# Altium schematic sheet Sheet2.SchDoc
size 209 x 297 mm; SheetNumber: 1; SheetTotal: 1
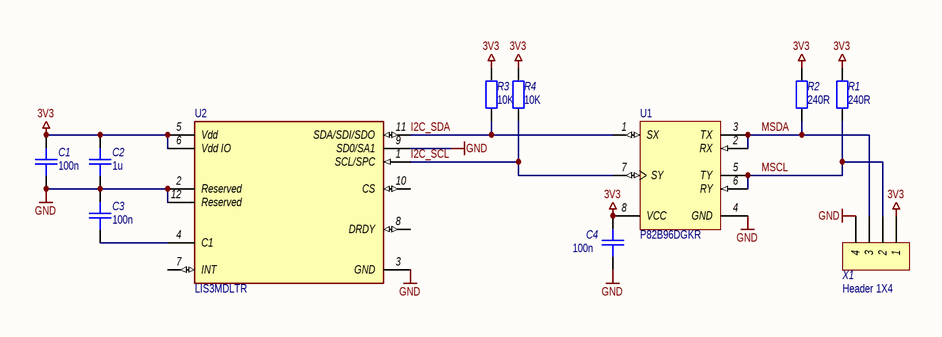
[diagram p0: Sheet2.SchDoc]

## Parts
C1  value 100n  [SMD_C0402]  (hidden comment: K10-79)
C2  value 1u  [SMD_C0402]  (hidden comment: K10-79)
C3  value 100n  [SMD_C0402]  (hidden comment: K10-79)
C4  value 100n  [SMD_C0402]  (hidden comment: K10-79)
R1  value 240R  [SMD_0402]  (hidden comment: OSM R1-8)
R2  value 240R  [SMD_0402]  (hidden comment: OSM R1-8)
R3  value 10K  [SMD_0402]  (hidden comment: OSM R1-8)
R4  value 10K  [SMD_0402]  (hidden comment: OSM R1-8)
U1  P82B96DGKR  [DGK0008A_M]
U2  LIS3MDLTR  [FP-VFLGA-12-8365767-MFG]
X1  Header 1X4  [PLS-4]

## Nets
3V3: C1.2 C2.2 C4.2 R1.2 R2.2 R3.1 R4.2 U1.8(VCC) U2.5(Vdd) U2.6(Vdd_IO) X1.1
GND: C1.1 C2.1 C3.2 C4.1 U1.4(GND) U2.2(Reserved) U2.3(GND) U2.9(SD0/SA1) U2.12(Reserved) X1.4
I2C_SCL: R4.1 U1.7(SY) U2.1(SCL/SPC)
I2C_SDA: R3.2 U1.1(SX) U2.11(SDA/SDI/SDO)
MSCL: R1.1 U1.5(TY) U1.6(RY) X1.2
MSDA: R2.1 U1.2(RX) U1.3(TX) X1.3
NetC3_1: C3.1 U2.4(C1)

Not connected (* = marked no-connect by the designer): U2 7(INT) 8(DRDY) 10(CS)

## Notes on the sheet
- Перв. примен.
- Справ. №
- Подп. и дата
- Инв. № дубл.
- Взам. инв. №
- Разраб.
- Изм.
- Лист
- № докум.
- Подп.
- Дата
- Литера
- Масса
- Масштаб
- Пров.
- Т.контр.
- Листов
- Инв. № подл.
- Н.контр.
- Утв.
- Форма 1 ГОСТ 2.104-2006
- Копировал
- Формат А4

## Library data of the parts
C1-C4 = Capacitor: Назначение: SMD-конденсатор; Наименование: К10-79; Потребление, Вт: 0; Точность: %; Напряжение: В; Диэлектрик: *
R1-R4 = Resistor: Наименование: ОСМ Р1-12; Назначение: SMD-резистор; Потребление, Вт: 0,001; Точность: %
U1 = CMP-0314-00301-2: Dual Bidirectional Bus Buffer, 2 Channel Width, 2.0 to 15.0 V, -40 to 85 degC, 8-pin MSOP (DGK), Green (RoHS & no Sb/Br); Manufacturer: Texas Instruments; VCC(Max)(V): 15; 5V Tolerant I/O: Yes; Channel Width: 2; SubFamily: I2C Hub, Buffer, Repeater; Slave Side I2C Bus Capacitance Supported(pF): 400; Назначение: I2C HUB; PackageReference: DGK0008A; Eco-Plan: Green (RoHS & no Sb/Br); DatasheetVersion: SCPS144B; VCC(Min)(V): 2; Code_JEDEC: MO-187-AA; Max Frequency(kHz): 400; PackageVersion: revE, May-2006; ComponentLink2URL: http://www.ti.com/litv/pdf/msoi002j; Vcc range(V): 2.0 to 15.0; Mounting Technology: Surface Mount; Master Side I2C Bus Capacitance Supported(pF): 400; No. of Outputs: 2; ComponentLink1Description: Datasheet; ComponentLink1URL: http://www.ti.com/general/docs/lit/getliterature.tsp?genericPartNumber=P82B96&fileType=pdf; PackageDescription: 8-Pin Thin Small Outline Package 3 x 3 mm Body ,0.65 mm Pitch; Open Drain I/O Type: Yes; ComponentLink2Description: Package Specification; PartNumber: P82B96DGKR; Наименование: P82B96DGKR
U2 = CMP-2000-07463-2: SENSOR MR I2C/SPI 12LGA; Manufacturer: STMicroelectronics; Sensor Output: I2C,SPI; Operating Supply Current: 40-270uA; Max Supply Voltage: 3.6V; Sensing Method: Magnetic; Min Supply Voltage: 1.71V; Назначение: 3-axis mag; ComponentLink2URL: https://www.st.com/resource/en/datasheet/lis3mdl.pdf; Category: IC; Manufacturer Part Number: LIS3MDLTR; Octopart: https://octopart.com/lis3mdltr-stmicroelectronics-29403125; Automotive: No; ComponentLink2Description: Datasheet; RoHS: TRUE; Device Class L3: unset; Device Class L1: Sensors; Temperature: -40°C to +85°C; Height: 1mm; Mouser Description: Board Mount Hall Effect / Magnetic Sensors Ultra Lo-Pwr Hi Perf 3-Axis 1.9-3.6V; Temperature Range High: +85°C; Lead Free: Yes; Device Class L2: Magnetic Sensors; Footprint Url: https://www.st.com/content/ccc/resource/technical/document/technical_note/73/17/9c/16/dd/96/4a/01/CD00134799.pdf/files/CD00134799.pdf/jcr:content/translations/en.CD00134799.pdf; Temperature Range Low: -40°C; Package: VFLGA-12-8365767; Digikey Description: SENSOR MR I2C/SPI 12LGA; Наименование: LIS3MDLTR
X1 = Header 1X4: Header, 4-Pin, Single row; Потребление, Вт: 0,0; Назначение: Header, 4-Pin, Single row; Наименование: Header 1X4